# EAGLE design astabil (EAGLE 9.0.0)
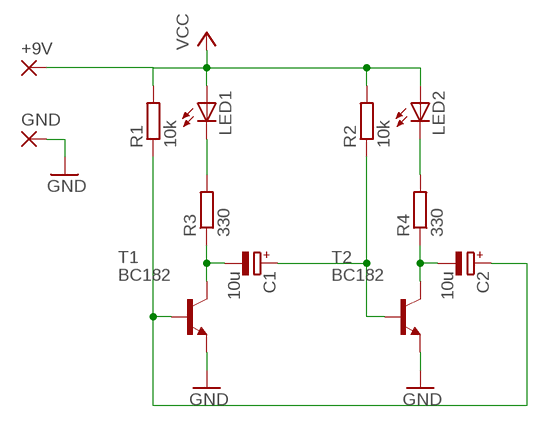
[diagram p0: schematic, sheet 1]

## Parts
+9V  2,54/1,0  [2,54/1,0]
C1  10u  CPOL-EUE3.5-8  [E3,5-8]
C2  10u  CPOL-EUE3.5-8  [E3,5-8]
GND  2,54/1,0  [2,54/1,0]
LED1  LED5MM  [LED5MM]
LED2  LED5MM  [LED5MM]
R1  10k  R-EU_0207/10  [0207/10]
R2  10k  R-EU_0207/10  [0207/10]
R3  330  R-EU_0207/10  [0207/10]
R4  330  R-EU_0207/10  [0207/10]
T1  BC182  BC547-NPN-TO92-CBE  [TO92-CBE]
T2  BC182  BC547-NPN-TO92-CBE  [TO92-CBE]

## Nets
GND: GND.1(P) T1.E T2.E
N$2: C2.+ R1.1 T1.B
N$3: C1.+ R2.1 T2.B
N$5: C1.- R3.1 T1.C
N$6: LED1.K(C) R3.2
N$7: C2.- R4.1 T2.C
N$9: LED2.K(C) R4.2
VCC: +9V.1(P) LED1.A LED2.A R1.2 R2.2

## Library data of the parts
+9V GND = wirepad:2,54/1,0: THROUGH-HOLE PAD
C1 C2 = resistor:CPOL-EU: POLARIZED CAPACITOR, European symbol
LED1 LED2 = led:LED: LED OSRAM: - CHIPLED LG R971, LG N971, LY N971, LG Q971, LY Q971, LO R971, LY R971 LH N974, LH R974 LS Q976, LO Q976, LY Q976 LO Q996 - Hyper CHIPLED LW Q18S LB Q993, LB Q99A, LB R99A - SideLED LS A670, LO A670, LY A670, LG A670, LP A670 LB A673, LV A673, LT A673, LW A673 LH A674 LY A675 LS A676, LA A676, LO A676, LY A676, LW A676 LS A679, LY A679, LG A679 - Hyper Micro SIDELED® LS Y876, LA Y876, LO Y876, LY Y876 LT Y87S - SmartLED LW L88C, LW L88S LB L89C, LB L89S, LG L890 LS L89K, LO L89K, LY L89K LS L896, LA L896, LO L896, LY L896 - TOPLED LS T670, LO T670, LY T670, LG T670, LP T670 LSG T670, LSP T670, LSY T670, LOP T670, LYG T670 LG T671, LOG T671, LSG T671 LB T673, LV T673, LT T673, LW T673 LH T674 LS T676, LA T676, LO T676, LY T676, LB T676, LH T676, LSB T676, LW T676 LB T67C, LV T67C, LT T67C, LS T67K, LO T67K, LY T67K, LW E67C LS E67B, LA E67B, LO E67B, LY E67B, LB E67C, LV E67C, LT E67C LW T67C LS T679, LY T679, LG T679 LS T770, LO T770, LY T770, LG T770, LP T770 LB T773, LV T773, LT T773, LW T773 LH T774 LS E675, LA E675, LY E675, LS T675 LS T776, LA T776, LO T776, LY T776, LB T776 LHGB T686 LT T68C, LB T68C - Hyper Mini TOPLED® LB M676 - Mini TOPLED Santana® LG M470 LS M47K, LO M47K, LY M47K Source: http://www.osram.convergy.de LUXEON: - LUMILED® LXK2-PW12-R00, LXK2-PW12-S00, LXK2-PW14-U00, LXK2-PW14-V00 LXK2-PM12-R00, LXK2-PM12-S00, LXK2-PM14-U00 LXK2-PE12-Q00, LXK2-PE12-R00, LXK2-PE12-S00, LXK2-PE14-T00, LXK2-PE14-U00 LXK2-PB12-K00, LXK2-PB12-L00, LXK2-PB12-M00, LXK2-PB14-N00, LXK2-PB14-P00, LXK2-PB14-Q00 LXK2-PR12-L00, LXK2-PR12-M00, LXK2-PR14-Q00, LXK2-PR14-R00 LXK2-PD12-Q00, LXK2-PD12-R00, LXK2-PD12-S00 LXK2-PH12-R00, LXK2-PH12-S00 LXK2-PL12-P00, LXK2-PL12-Q00, LXK2-PL12-R00 Source: www.luxeon.com KINGBRIGHT: KA-3528ASYC Source: www.kingbright.com
R1-R4 = resistor:R-EU_: RESISTOR, European symbol
T1 T2 = transistor:*-NPN-: NPN Transistror BF959 corrected 2008.03.06

## Board
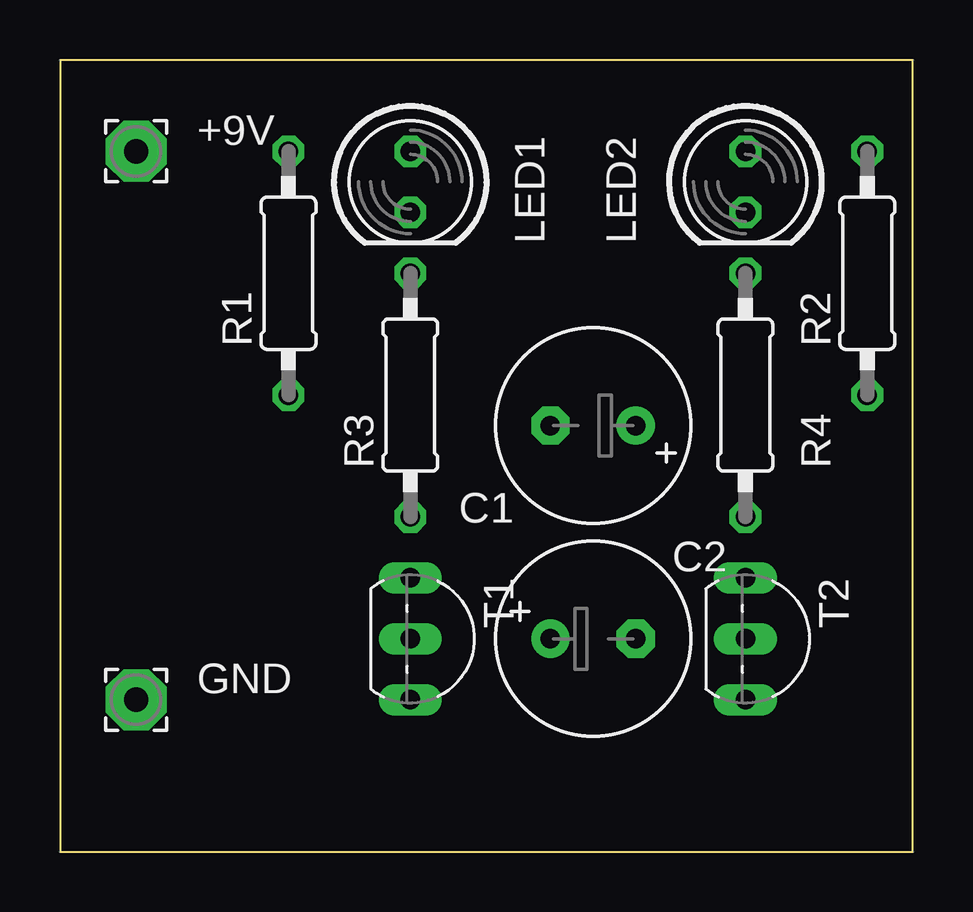
[diagram p1: board, top side]
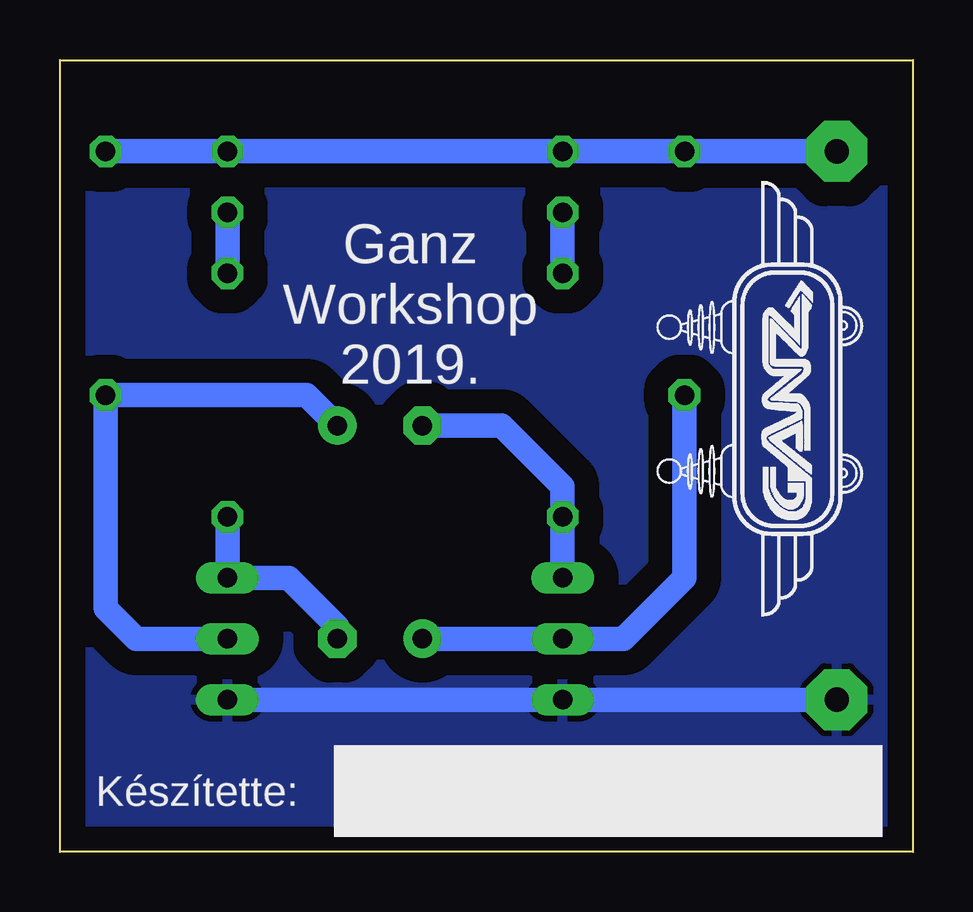
[diagram p2: board, bottom side, seen from below]

Size 35.56 x 33.02 mm. Coordinates in mm from the lower left corner, seen from the top.
Outline: 0,0 35.56,0 35.56,33.02 0,33.02 0,0
Copper layers (1*16): Top 0.035mm / dielectric 1.5mm / Bottom 0.035mm
Design rules "default *": minimum track width 10mil, minimum drill 24mil, track to track 8mil, track to pad 8mil, pad to pad 8mil, via to via 8mil, smd to smd 8mil, copper to edge 40mil, drill to drill 8mil, minimum pad ring 10mil, minimum via ring 8mil, stop-mask expansion 4mil, vias tented up to drill 0mil, thermal gap 10mil

### Footprints (pad centres in the part's own frame; a part is rotated, then mirrored left to right if it is on the bottom)
2,54/1,0 = drill 1.016 pad 2.54 octagon: 1 0,0
E3,5-8 = drill 0.813 pad 1.6: + -1.778,0 | drill 0.813 pad 1.6 octagon: - 1.778,0
LED5MM = drill 0.813 octagon: A -1.27,0; K 1.27,0
0207/10 = drill 0.813 octagon: 1 -5.08,0; 2 5.08,0
TO92-CBE = drill 0.813 long: B 0,0; C -2.54,0; E 2.54,0

### Placement (x,y rotation side)
+9V  3.17,29.21 0 top
C1  22.23,17.78 180 top
C2  22.23,8.89 0 top
GND  3.17,6.35 180 top
LED1  14.61,27.94 270 top
LED2  28.57,27.94 270 top
R1  9.53,24.13 90 top
R2  33.66,24.13 90 top
R3  14.61,19.05 90 top
R4  28.57,19.05 90 top
T1  14.61,8.89 270 top
T2  28.57,8.89 270 top

### Tracks (layer width: path | path; a pad name or v marks a point on that pad's centre or on a via)
GND
  Bottom 1.016: GND.1 T1.E T2.E
  pour Bottom (isolate 1.016): 0.64,32.38 34.92,32.38 34.92,0.63 0.64,0.63
N$2
  Bottom 1.016: R1.1 9.53,11.43 12.06,8.89 T1.B C2.+
N$3
  Bottom 1.016: C1.+ 25.27,19.05 R2.1 33.66,10.16 32.38,8.89 T2.B
N$5
  Bottom 1.016: T1.C R3.1 14.61,15.24 17.14,17.78 C1.-
N$6
  Bottom 1.016: LED1.K R3.2
N$7
  Bottom 1.016: R4.1 T2.C 26.04,11.43 24,9.4 C2.-
N$9
  Bottom 1.016: LED2.K R4.2
VCC
  Bottom 1.016: LED2.A R2.2 LED1.A R1.2 +9V.1

### Text on the board
bPlace: Ganz / Workshop / 2019. | Készítette: